# EAGLE design QuadcopterFinal (EAGLE 8.4.1)
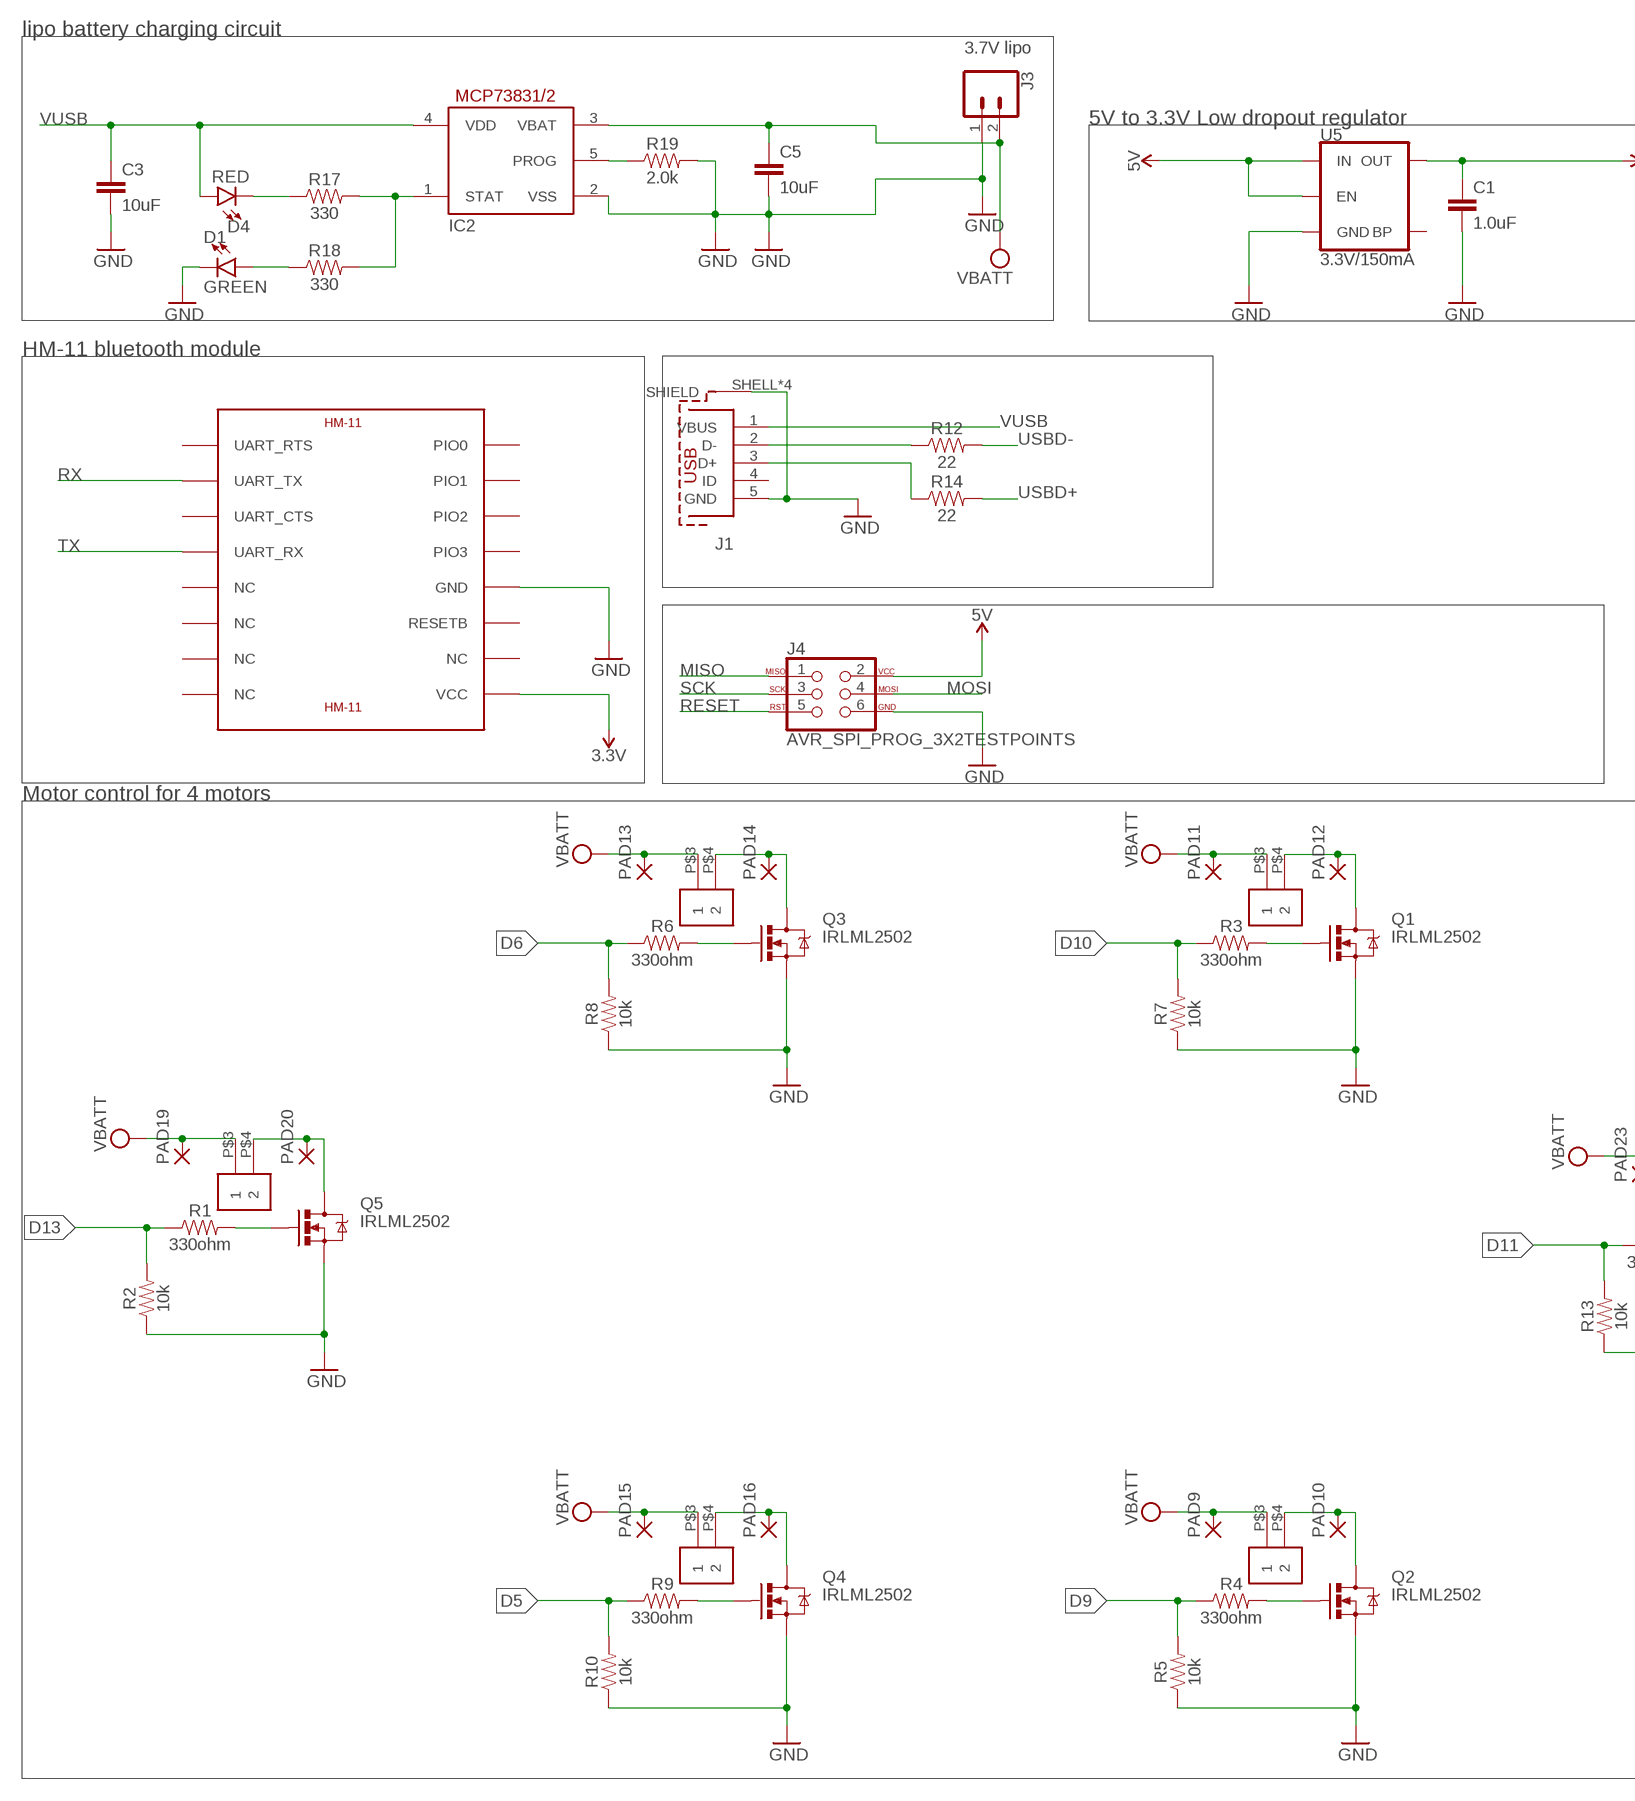
[diagram p0: schematic, sheet 1, part 1 of 2]
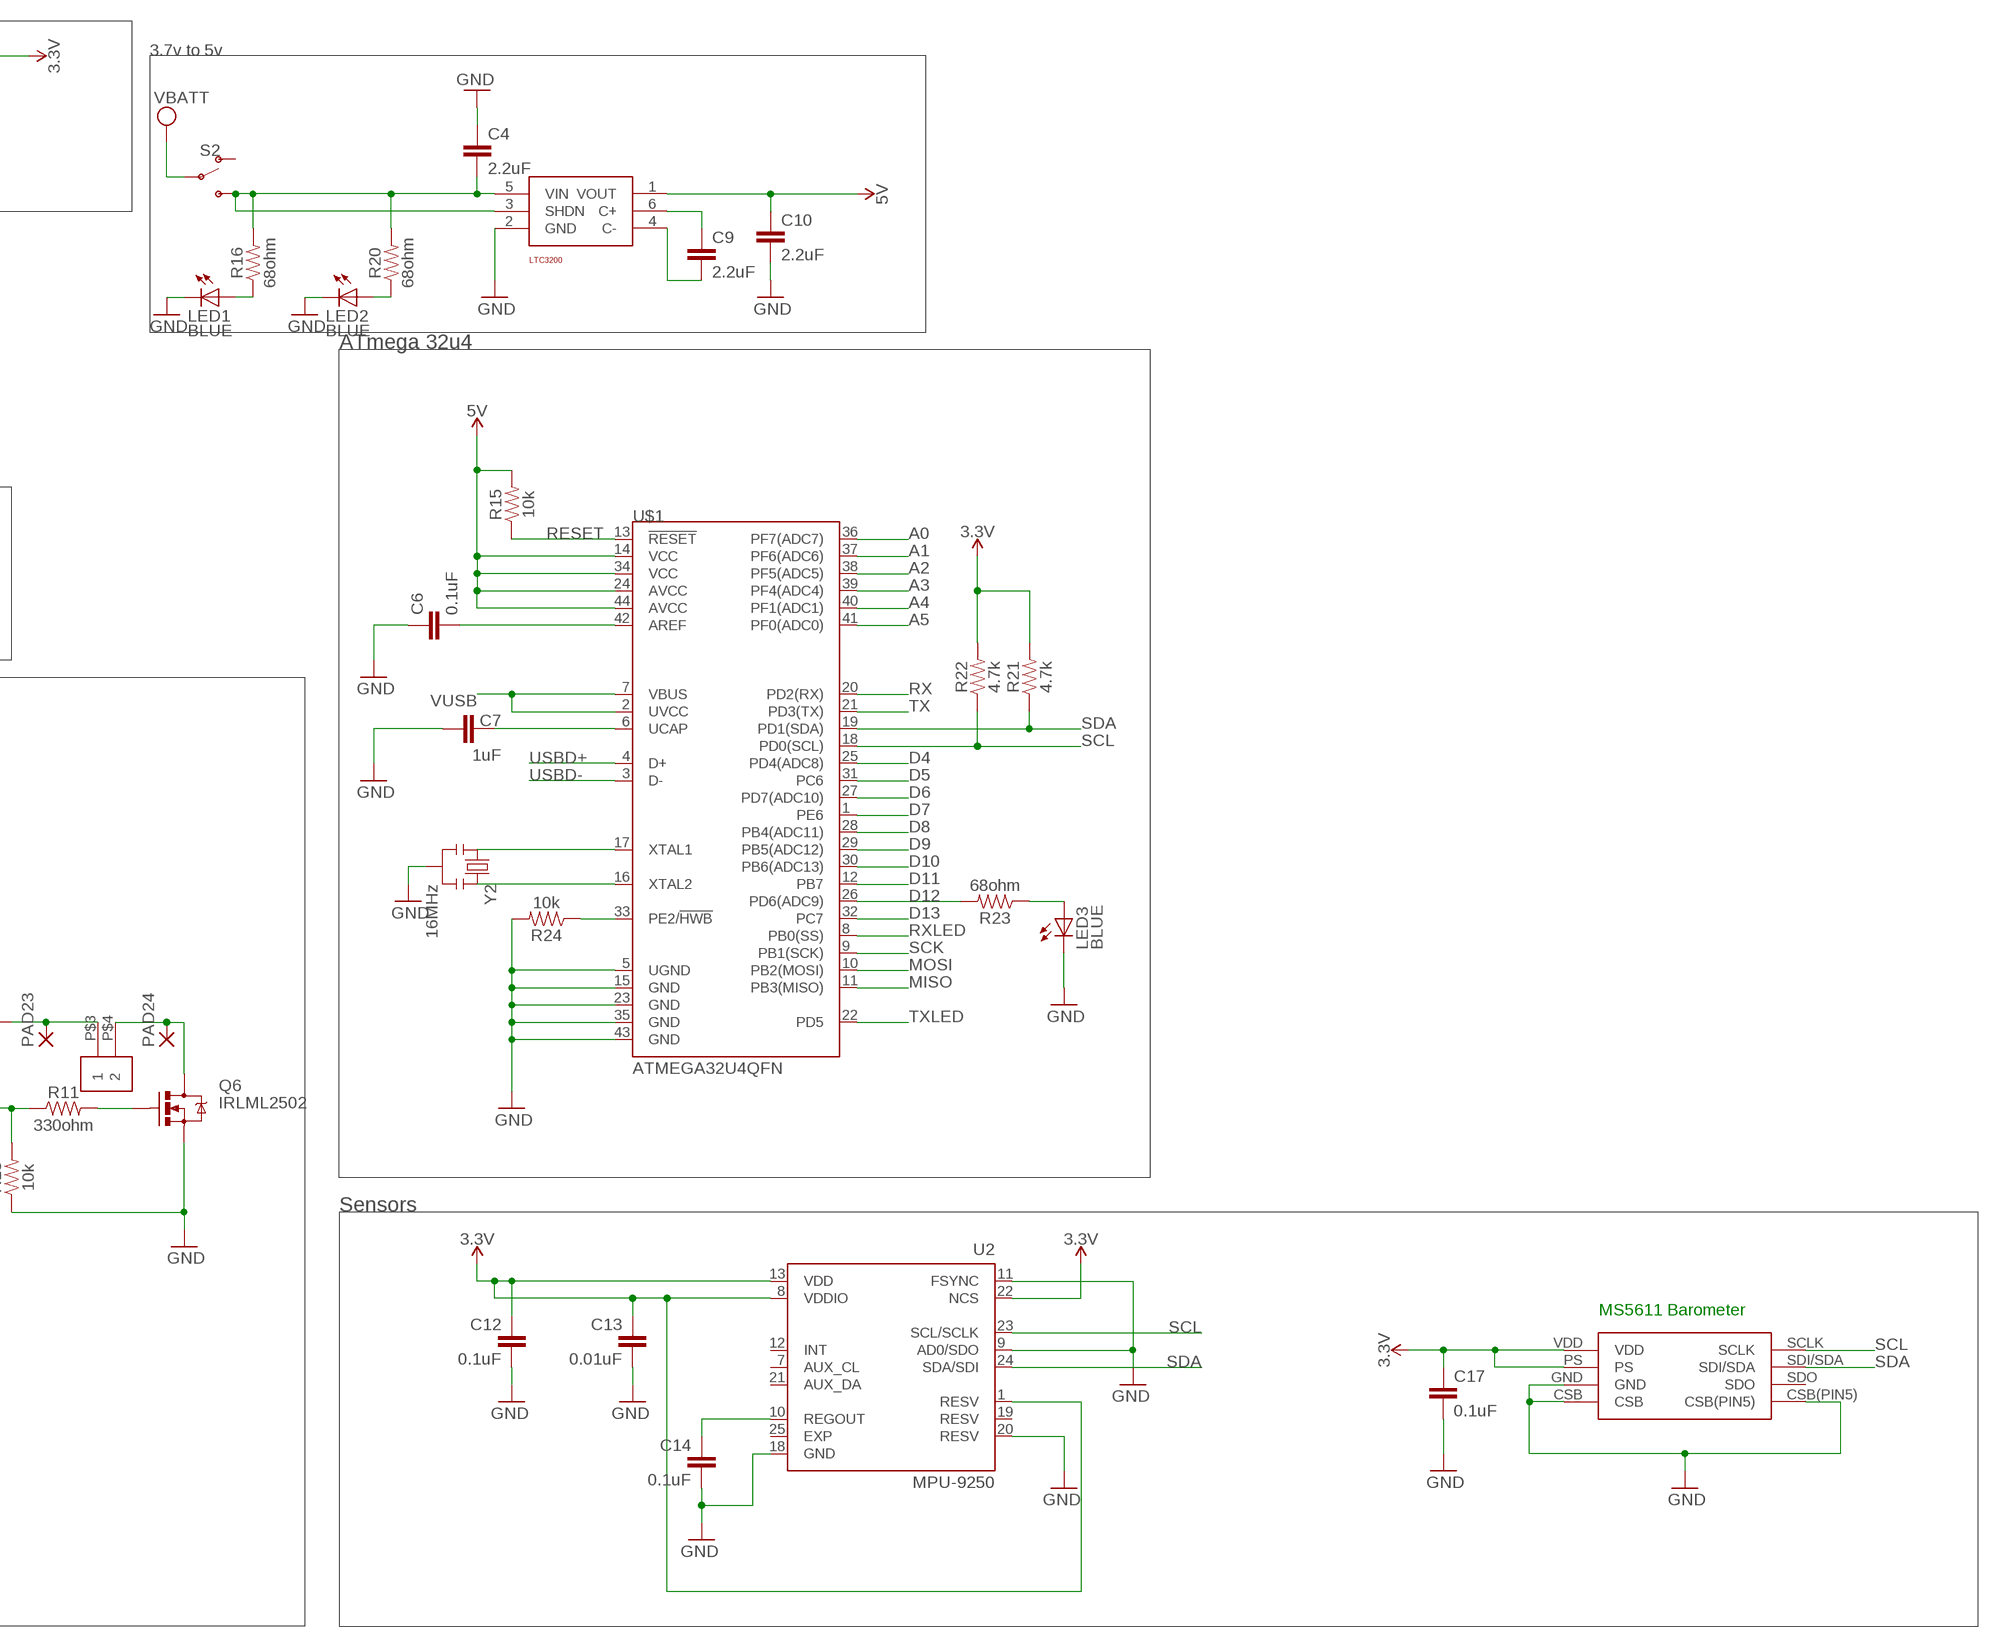
[diagram p1: schematic, sheet 1, part 2 of 2]

## Parts
C1  1.0uF  1.0UF-0402-16V-10%  [0402]
C3  10uF  10UF-0603-6.3V-20%  [0603]
C4  2.2uF  2.2UF-0603-10V-20%  [0603]
C5  10uF  10UF-0603-6.3V-20%  [0603]
C6  0.1uF  0.1UF-0402-16V-10%  [0402]
C7  1uF  0.1UF-0402-16V-10%  [0402]
C9  2.2uF  2.2UF-0603-10V-20%  [0603]
C10  2.2uF  2.2UF-0603-10V-20%  [0603]
C12  0.1uF  0.1UF-0402-16V-10%  [0402]
C13  0.01uF  C-EUC0402  [C0402]
C14  0.1uF  0.1UF-0402-16V-10%  [0402]
C17  0.1uF  0.1UF-0402-16V-10%  [0402]
D1  GREEN  LED-GREEN0603  [LED-0603]
D4  RED  LED-RED0603  [LED-0603]
IC2  MCP73831/OT  [SOT23-5L]
J1  629105136821  [629105136821]
J3  CONN_021X02_NO_SILK  [1X02_NO_SILK]
J4  AVR_SPI_PROG_3X2TESTPOINTS  [2X3_TEST_POINTS]
LED1  BLUE  LEDCHIPLED_1206  [CHIPLED_1206]
LED2  BLUE  LEDCHIPLED_1206  [CHIPLED_1206]
LED3  BLUE  LEDCHIPLED_1206  [CHIPLED_1206]
LTC3200  LTC3200  [LTC3200]
PAD9  SMD2  [SMD1,27-2,54]
PAD10  SMD2  [SMD1,27-2,54]
PAD11  SMD2  [SMD1,27-2,54]
PAD12  SMD2  [SMD1,27-2,54]
PAD13  SMD2  [SMD1,27-2,54]
PAD14  SMD2  [SMD1,27-2,54]
PAD15  SMD2  [SMD1,27-2,54]
PAD16  SMD2  [SMD1,27-2,54]
PAD19  SMD2  [SMD1,27-2,54]
PAD20  SMD2  [SMD1,27-2,54]
PAD23  SMD2  [SMD1,27-2,54]
PAD24  SMD2  [SMD1,27-2,54]
Q1  IRLML2502  MOSFET-NCHANNELBSS138  [SOT23]
Q2  IRLML2502  MOSFET-NCHANNELBSS138  [SOT23]
Q3  IRLML2502  MOSFET-NCHANNELBSS138  [SOT23]
Q4  IRLML2502  MOSFET-NCHANNELBSS138  [SOT23]
Q5  IRLML2502  MOSFET-NCHANNELBSS138  [SOT23]
Q6  IRLML2502  MOSFET-NCHANNELBSS138  [SOT23]
R1  330ohm  330OHM-0603-1/10W-1%  [0603]
R2  10k  10KOHM-0603-1/10W-1%  [0603]
R3  330ohm  330OHM-0603-1/10W-1%  [0603]
R4  330ohm  330OHM-0603-1/10W-1%  [0603]
R5  10k  10KOHM-0603-1/10W-1%  [0603]
R6  330ohm  330OHM-0603-1/10W-1%  [0603]
R7  10k  10KOHM-0603-1/10W-1%  [0603]
R8  10k  10KOHM-0603-1/10W-1%  [0603]
R9  330ohm  330OHM-0603-1/10W-1%  [0603]
R10  10k  10KOHM-0603-1/10W-1%  [0603]
R11  330ohm  330OHM-0603-1/10W-1%  [0603]
R12  22  22OHM-0402-1/10W-1%  [0402]
R13  10k  10KOHM-0603-1/10W-1%  [0603]
R14  22  22OHM-0402-1/10W-1%  [0402]
R15  10k  10KOHM-0603-1/10W-1%  [0603]
R16  68ohm  330OHM-0603-1/10W-1%  [0603]
R17  330  330OHM-0603-1/10W-1%  [0603]
R18  330  330OHM-0603-1/10W-1%  [0603]
R19  2.0k  2.0KOHM-0603-1/10W-5%  [0603]
R20  68ohm  330OHM-0603-1/10W-1%  [0603]
R21  4.7k  4.7KOHM-0603-1/10W-1%  [0603]
R22  4.7k  4.7KOHM-0603-1/10W-1%  [0603]
R23  68ohm  330OHM-0603-1/10W-1%  [0603]
R24  10k  10KOHM-0603-1/10W-1%  [0603]
S2  SWITCH-SPDT-SMD-RIGHT-ANGLE  [SWITCH_SPST_SMD_A]
U2  MPU-9250  [QFN40P300X300X105-25N]
U5  3.3V/150mA  V_REG_MIC52053.3V  [SOT23-5]
U$1  ATMEGA32U4QFN  [SPARKFUN-DIGITALIC_QFN-44]
U$2  QUADARM  [QUADARM]
U$3  QUADARM  [QUADARM]
U$4  QUADARM  [QUADARM]
U$5  QUADARM  [QUADARM]
U$6  HM-11  [HM-11]
U$7  QUADARM  [QUADARM]
U$8  QUADARM  [QUADARM]
U$9  MS5611-01BA01  [MS5611-01BA01]
Y2  16MHz  RESONATOR16MHZ  [RESONATOR-SMD]

## Nets
3.3V: C1.1 C12.1 C13.1 C17.1 R21.2 R22.2 U2.1(RESV) U2.8(VDDIO) U2.13(VDD) U2.22(NCS) U5.5(OUT) U$6.VCC U$9.PS U$9.VDD
5V: C10.1 J4.2 LTC3200.1(VOUT) R15.2 U5.1(IN) U5.3(EN) U$1.14(VCC) U$1.24(AVCC) U$1.34(VCC) U$1.44(AVCC)
A0: U$1.36(PF7(ADC7))
A1: U$1.37(PF6(ADC6))
A2: U$1.38(PF5(ADC5))
A3: U$1.39(PF4(ADC4))
A4: U$1.40(PF1(ADC1))
A5: U$1.41(PF0(ADC0))
D4: U$1.25(PD4(ADC8))
D5: R9.1 R10.2 U$1.31(PC6)
D6: R6.1 R8.2 U$1.27(PD7(ADC10))
D7: U$1.1(PE6)
D8: U$1.28(PB4(ADC11))
D9: R4.1 R5.2 U$1.29(PB5(ADC12))
D10: R3.1 R7.2 U$1.30(PB6(ADC13))
D11: R11.1 R13.2 U$1.12(PB7)
D12: R23.2 U$1.26(PD6(ADC9))
D13: R1.1 R2.2 U$1.32(PC7)
GND: C1.2 C3.2 C4.1 C5.2 C6.1 C7.1 C10.2 C12.2 C13.2 C14.2 C17.2 D1.C IC2.2(VSS) J1.5(GND) J1.SHELL1(SHIELD) J1.SHELL2(SHIELD) J1.SHELL3(SHIELD) J1.SHELL(SHIELD) J3.1 J4.6 LED1.C LED2.C LED3.C LTC3200.2(GND) Q1.2(S) Q2.2(S) Q3.2(S) Q4.2(S) Q5.2(S) Q6.2(S) R2.1 R5.1 R7.1 R8.1 R10.1 R13.1 R19.2 R24.2 U2.9(AD0/SDO) U2.11(FSYNC) U2.18(GND) U2.20(RESV) U5.2(GND) U$1.5(UGND) U$1.15(GND) U$1.23(GND) U$1.35(GND) U$1.43(GND) U$6.GND U$9.CSB U$9.CSB(PIN5) U$9.GND Y2.2
MISO: J4.1 U$1.11(PB3(MISO))
MOSI: J4.4 U$1.10(PB2(MOSI))
N$1: Q5.1(G) R1.2
N$2: C4.2 LTC3200.3(SHDN) LTC3200.5(VIN) R16.2 R20.2 S2.3(S)
N$3: PAD20.1(P) Q5.3(D) U$7.P$4
N$4: Q6.1(G) R11.2
N$5: LED1.A R16.1
N$7: PAD24.1(P) Q6.3(D) U$8.P$4
N$8: Q1.1(G) R3.2
N$9: PAD12.1(P) Q1.3(D) U$3.P$4
N$10: LED2.A R20.1
N$11: Q2.1(G) R4.2
N$12: PAD10.1(P) Q2.3(D) U$2.P$4
N$13: J1.2(D-) R12.1
N$14: Q3.1(G) R6.2
N$15: PAD14.1(P) Q3.3(D) U$4.P$4
N$16: J1.3(D+) R14.1
N$17: Q4.1(G) R9.2
N$18: PAD16.1(P) Q4.3(D) U$5.P$4
N$22: U$1.17(XTAL1) Y2.1
N$23: C9.1 LTC3200.6(C+)
N$24: C14.1 U2.10(REGOUT)
N$25: C9.2 LTC3200.4(C-)
N$26: D4.C R17.1
N$27: IC2.1(STAT) R17.2 R18.2
N$28: D1.A R18.1
N$29: U$1.16(XTAL2) Y2.3
N$30: LED3.A R23.1
N$32: IC2.5(PROG) R19.1
N$33: R24.1 U$1.33(PE2/!HWB)
N$34: C6.2 U$1.42(AREF)
N$36: C7.2 U$1.6(UCAP)
RESET: J4.5 R15.1 U$1.13(!RESET)
RX: U$1.20(PD2(RX)) U$6.UART_TX
RXLED: U$1.8(PB0(SS))
SCK: J4.3 U$1.9(PB1(SCK))
SCL: R22.1 U2.23(SCL/SCLK) U$1.18(PD0(SCL)) U$9.SCLK
SDA: R21.1 U2.24(SDA/SDI) U$1.19(PD1(SDA)) U$9.SDI/SDA
TX: U$1.21(PD3(TX)) U$6.UART_RX
TXLED: U$1.22(PD5)
USBD+: R14.2 U$1.4(D+)
USBD-: R12.2 U$1.3(D-)
VDD: C5.1 IC2.3(VBAT) J3.2 PAD9.1(P) PAD11.1(P) PAD13.1(P) PAD15.1(P) PAD19.1(P) PAD23.1(P) S2.2(P) U$2.P$3 U$3.P$3 U$4.P$3 U$5.P$3 U$7.P$3 U$8.P$3 ; supply symbol labelled VBATT
VUSB: C3.1 D4.A IC2.4(VDD) J1.1(VBUS) U$1.2(UVCC) U$1.7(VBUS)
Unconnected: J1.4(ID) S2.1(O) U2.7(AUX_CL) U2.12(INT) U2.21(AUX_DA) U5.4(BP) U$6.NC@5(NC) U$6.NC@6(NC) U$6.NC@7(NC) U$6.NC@8(NC) U$6.NC@10(NC) U$6.PIO0 U$6.PIO1 U$6.PIO2 U$6.PIO3 U$6.RESETB U$6.UART_CTS U$6.UART_RTS U$9.SDO

## Notes on the sheet
- lipo battery charging circuit
- 3.7V lipo
- 5V to 3.3V Low dropout regulator
- 3.7v to 5v
- HM-11 bluetooth module
- ATmega 32u4
- Motor control for 4 motors
- Sensors
- MS5611 Barometer

## Power pins joined to a net without a drawn wire
EXP: U2.25(EXP)
RESV: U2.19(RESV)

## Library data of the parts
C1 = SparkFun-Capacitors:1.0UF: 1µF ceramic capacitors A capacitor is a passive two-terminal electrical component used to store electrical energy temporarily in an electric field.; PROD_ID: CAP-12417
C3 C5 = SparkFun-Capacitors:10UF: 10.0µF ceramic capacitors A capacitor is a passive two-terminal electrical component used to store electrical energy temporarily in an electric field.; PROD_ID: CAP-11015
C4 C9 C10 = SparkFun-Capacitors:2.2UF: 2.2µF ceramic capacitors A capacitor is a passive two-terminal electrical component used to store electrical energy temporarily in an electric field.; PROD_ID: CAP-07888
C6 C12 C14 C17 = SparkFun-Capacitors:0.1UF: 0.1µF ceramic capacitors A capacitor is a passive two-terminal electrical component used to store electrical energy temporarily in an electric field.; PROD_ID: CAP-12416
C7 = SparkFun-Capacitors:0.1UF: 0.1µF ceramic capacitors A capacitor is a passive two-terminal electrical component used to store electrical energy temporarily in an electric field.; PROD_ID: CAP-12416; VALUE: 0.1uF
C13 = rcl:C-EU: CAPACITOR, European symbol
D1 = SparkFun-LED:LED-GREEN: Green SMD LED Used in manufacturing of various products at SparkFun Packages: 0603 - SMD 0603 package [Product Link] <http://www.futureelectronics.com/en/technologies/semiconductors/optoelectronics/leds/Pages/9894312-LTST-C190GKT.aspx?CrossPart=HSMG-C190&IM=0> LilyPad 1206 - SMD1206 LilyPad package [Product Link] <http://www.futureelectronics.com/en/Technologies/Product.aspx?ProductID=IN150NGHARVATEKCORPORATION2049943&IM=0> 1206 - SMD1206 package [Product Link] <http://www.futureelectronics.com/en/technologies/semiconductors/optoelectronics/leds/Pages/8315665-LTST-C150KGKT.aspx?IM=0> 1206 Bottom Mount -SMD 1206 Bottom Mount [Product Link] <http://www.digikey.com/product-detail/en/lite-on-inc/LTST-C230KGKT/160-1456-1-ND/386854> SparkFun Products: Pro Mini 328 -5V <https://www.sparkfun.com/products/821> RedBoard <https://www.sparkfun.com/products/12757> MP3 Trigger <https://www.sparkfun.com/products/13720> Makey Makey <https://www.sparkfun.com/products/11076>; PROD_ID: DIO-00821
D4 = SparkFun-LED:LED-RED: Red SMD LED Used in manufacturing of most products at SparkFun Packages: 0603 - SMD 0603 package [Product Link] <http://docs.avagotech.com/docs/AV02-0551EN> 0603 SMART - SMD 0603 SMART package ( more efficient and expensive)[Product Link] <http://www.osram-os.com/Graphics/XPic2/00077099_0.pdf> 1206 - SMD1206 package [Product Link] <https://www.sparkfun.com/datasheets/DevTools/LilyPad/Q150OVS4.pdff> SparkFun Products: Pro Mini 328 -5V <https://www.sparkfun.com/products/821> RedBoard <https://www.sparkfun.com/products/12757> IOIO-OTG <https://www.sparkfun.com/products/13613>; PROD_ID: DIO-00819
IC2 = adafruit:MCP73831: MCP73831/2 Miniature Single-Cell, Fully Integrated Li-Ion, Li-Polymer Charge Management Controllers. Nice and small simple lipoly charge controller, with adjustable current and status output (LED) http://www.ladyada.net/library/pcb/eaglelibrary.html
J1 = EAGLE-INPUT_OUTPUT_CONNECTORS-rev17b:629105136821: WR-COM SMT Horizontal 5 Contacts Micro USB Type B,5 pins=>Code : Con_I-O_COM_MicroUSB_629105136821 <http://katalog.we-online.de/media/images/eican/Con_I-O_COM_MicroUSB_629105136821_pf2.jpg> Details see: http://katalog.we-online.de/en/em/COM_MICRO_SMT_TYPE_B_HORIZONTAL/629105136821?m Created 2014-07-09, Karrer Zheng 2014 (C) Würth Elektronik
J3 = SparkFun-Connectors:CONN_02: Multi connection point. Often used as Generic Header-pin footprint for 0.1 inch spaced/style header connections On any of the 0.1 inch spaced packages, you can populate with these: Break Away Headers - Straight <https://www.sparkfun.com/products/116> (PRT-00116) Break Away Male Headers - Right Angle <https://www.sparkfun.com/products/553> (PRT-00553) Female Headers <https://www.sparkfun.com/products/115> (PRT-00115) Break Away Headers - Machine Pin <https://www.sparkfun.com/products/117> (PRT-00117) Break Away Female Headers - Swiss Machine Pin <https://www.sparkfun.com/products/743> (PRT-00743) For SCREWTERMINALS and SPRING TERMINALS visit here: Screw Terimnals on SparkFun.com <https://www.sparkfun.com/search/results?term=Screw+Terminals> (5mm/3.5mm/2.54mm spacing) This device is also useful as a general connection point to wire up your design to another part of your project. Our various solder wires solder well into these plated through hole pads. Hook-Up Wire - Assortment (Stranded, 22 AWG) <https://www.sparkfun.com/products/11375> (PRT-11375) Hook-Up Wire - Assortment (Solid Core, 22 AWG) <https://www.sparkfun.com/products/11367> (PRT-11367) View the entire wire category on our website here <https://www.sparkfun.com/categories/141> Special notes: Molex polarized connector foot print use with: PRT-08233 with associated crimp pins and housings. 2.54_SCREWTERM for use with PRT-10571. 3.5mm Screw Terminal footprints for PRT-08084 5mm Screw Terminal footprints for use with PRT-08432
J4 = SparkFun-Connectors:AVR_SPI_PROG_3X2: AVR ISP 6 Pin This is the reduced ISP connector for AVR programming. Common on Arduino. This footprint will take up less PCB space and can be used with a 10-pin to 6-pin adapter such as SKU: BOB-08508 **Special note about "TEST_POINT" package. The stop mask is on the top side, so if you want your programming test points to be on the bottom of your board, make sure to place this package on the bottom side of the board. This also ensure that the orientation to program from the bottom side will be correct. SparkFun Products: SparkFun ISP Pogo Adapter <https://www.sparkfun.com/products/11591> - NS Tiny AVR Programmer <https://www.sparkfun.com/products/11801> -PTH
LED1-LED3 = adafruit:LED: LED OSRAM: - CHIPLED LG R971, LG N971, LY N971, LG Q971, LY Q971, LO R971, LY R971 LH N974, LH R974 LS Q976, LO Q976, LY Q976 LO Q996 - Hyper CHIPLED LW Q18S LB Q993, LB Q99A, LB R99A - SideLED LS A670, LO A670, LY A670, LG A670, LP A670 LB A673, LV A673, LT A673, LW A673 LH A674 LY A675 LS A676, LA A676, LO A676, LY A676, LW A676 LS A679, LY A679, LG A679 - Hyper Micro SIDELED® LS Y876, LA Y876, LO Y876, LY Y876 LT Y87S - SmartLED LW L88C, LW L88S LB L89C, LB L89S, LG L890 LS L89K, LO L89K, LY L89K LS L896, LA L896, LO L896, LY L896 - TOPLED LS T670, LO T670, LY T670, LG T670, LP T670 LSG T670, LSP T670, LSY T670, LOP T670, LYG T670 LG T671, LOG T671, LSG T671 LB T673, LV T673, LT T673, LW T673 LH T674 LS T676, LA T676, LO T676, LY T676, LB T676, LH T676, LSB T676, LW T676 LB T67C, LV T67C, LT T67C, LS T67K, LO T67K, LY T67K, LW E67C LS E67B, LA E67B, LO E67B, LY E67B, LB E67C, LV E67C, LT E67C LW T67C LS T679, LY T679, LG T679 LS T770, LO T770, LY T770, LG T770, LP T770 LB T773, LV T773, LT T773, LW T773 LH T774 LS E675, LA E675, LY E675, LS T675 LS T776, LA T776, LO T776, LY T776, LB T776 LHGB T686 LT T68C, LB T68C - Hyper Mini TOPLED® LB M676 - Mini TOPLED Santana® LG M470 LS M47K, LO M47K, LY M47K Source: http://www.osram.convergy.de/; OC_NEWARK: unknown
LTC3200 = QuadcopterFinal:LTC3200: Smooth 5v output
PAD9-PAD16 PAD19 PAD20 PAD23 PAD24 = wirepad:SMD2: SMD PAD; OC_NEWARK: unknown
Q1-Q6 = SparkFun-DiscreteSemi:MOSFET-NCHANNEL: Common NMOSFET Parts MFG P/N Store ID Prod ID FDD8780 TRANS-09984 SI7820DN TRANS-11055 FDS6630A IC-08089 2N7002PW TRANS-11151 FQP30N06L COM-10213 TRANS-10060 BSS123LT1G TRANS-08345 BSS138 TRANS-00830 BS170 2N7000; OC_NEWARK: unknown; PROD_ID: TRANS-00830
R1 R3 R4 R6 R9 R11 R16 R20 R23 = SparkFun-Resistors:330OHM: 330Ω resistor A resistor is a passive two-terminal electrical component that implements electrical resistance as a circuit element. Resistors act to reduce current flow, and, at the same time, act to lower voltage levels within circuits. - Wikipedia; OC_NEWARK: unknown; PROD_ID: RES-00818; VALUE: 330
R2 R5 R7 R8 R10 R13 R15 R24 = SparkFun-Resistors:10KOHM: 10kΩ resistor A resistor is a passive two-terminal electrical component that implements electrical resistance as a circuit element. Resistors act to reduce current flow, and, at the same time, act to lower voltage levels within circuits. - Wikipedia; OC_NEWARK: unknown; PROD_ID: RES-00824
R12 R14 = SparkFun-Resistors:22OHM: 22Ω resistor A resistor is a passive two-terminal electrical component that implements electrical resistance as a circuit element. Resistors act to reduce current flow, and, at the same time, act to lower voltage levels within circuits. - Wikipedia; PROD_ID: RES-12427
R17 R18 = SparkFun-Resistors:330OHM: 330Ω resistor A resistor is a passive two-terminal electrical component that implements electrical resistance as a circuit element. Resistors act to reduce current flow, and, at the same time, act to lower voltage levels within circuits. - Wikipedia; PROD_ID: RES-00818
R19 = SparkFun-Resistors:2.0KOHM: 2kΩ resistor A resistor is a passive two-terminal electrical component that implements electrical resistance as a circuit element. Resistors act to reduce current flow, and, at the same time, act to lower voltage levels within circuits. - Wikipedia; PROD_ID: RES-08296
R21 R22 = SparkFun-Resistors:4.7KOHM: 4.7kΩ resistor A resistor is a passive two-terminal electrical component that implements electrical resistance as a circuit element. Resistors act to reduce current flow, and, at the same time, act to lower voltage levels within circuits. - Wikipedia; PROD_ID: RES-07857
S2 = SparkFun-Switches:SWITCH-SPDT: Single Pole, Double Throw (SPDT) Switch Single-pole, double-throw (SPDT) switch. Variant Overview SMD-AYZ0202 Surface Mount DPDT Switch <https://www.sparkfun.com/products/597> (COM-00597) Used on e.g. LilyPad Arduino USB - ATmega32U4 Board <https://www.sparkfun.com/products/12049> PTH-11.6X4.0MM SPDT Mini Power Switch <https://www.sparkfun.com/products/102> (COM-00102) Used on e.g. SparkFun Simon Says - Through-Hole Soldering Kit <https://www.sparkfun.com/products/10547> (KIT-10547) PTH-11.6X4.0MM-KIT KIT version of SPDT Mini Power Switch - Simplifies soldering by removing tStop of switch pins - only one side can be soldered. PTH-11.6X4.0MM-LOCK LOCK version of SPDT Mini Power Switch - Offset pins hold switch in place for easier soldering. SMD-RIGHT-ANGLE Surface Mount Right Angle Switch <https://www.sparkfun.com/products/10860> (COM-10860) Used on e.g. SparkFun ESP8266 Thing <https://www.sparkfun.com/products/13231>; PROD_ID: SWCH-10651; SF_SKU: COM-10860
U2 = MPU-9250:MPU-9250: GYRO/ACCEL/COMPASS/9-AXIS; AVAILABILITY: Good; DESCRIPTION: SMD Gyroscope/Accelerometer/Magnetometer Sensor%3B 9-AXIS; MF: InvenSense; MP: MPU-9250; PACKAGE: QFN-24 InvenSense; PRICE: 6.33 USD
U5 = SparkFun-IC-Power:V_REG_MIC5205: V_REG MIC5205 Standard 3.3V, 5V, and Adjustable 150mA LDO voltage regulator in SOT-23 layout. Micrel part MIC5205. BP (by-pass) pin is used to lower output noise with 470pF cap, may be left open. On the adjustable version BP is used to set output.; PROD_ID: VREG-00822
U$1 = SparkFun-Retired:ATMEGA32U4: Atmel 44-pin 8-bit Microcontroller with 32KBytes of ISP Flash and USB Controller ----- Please use the QFN-44-NOPAD_1:1 package for the footprint of all boards using a 32U4. Route traces directly away from the pads as much as possible.
U$2-U$5 U$7 U$8 = quadcopter:QUADARM; OC_NEWARK: unknown
U$6 = HM-11:HM-11: JNHuaMao HM-11 Bluetooth 4.0 Transceiver based on TI CC2540/CC2541
U$9 = freeimu-components:MS5611-01BA01
Y2 = SparkFun-FreqCtrl:RESONATOR: Resonator Small SMD resonator. Used, eg, on the Arduino Pro/ Pro Mini boards. 8MHz- XTAL-08895 16MHz- XTAL-08900; OC_NEWARK: unknown; PROD_ID: XTAL-08900

## Board
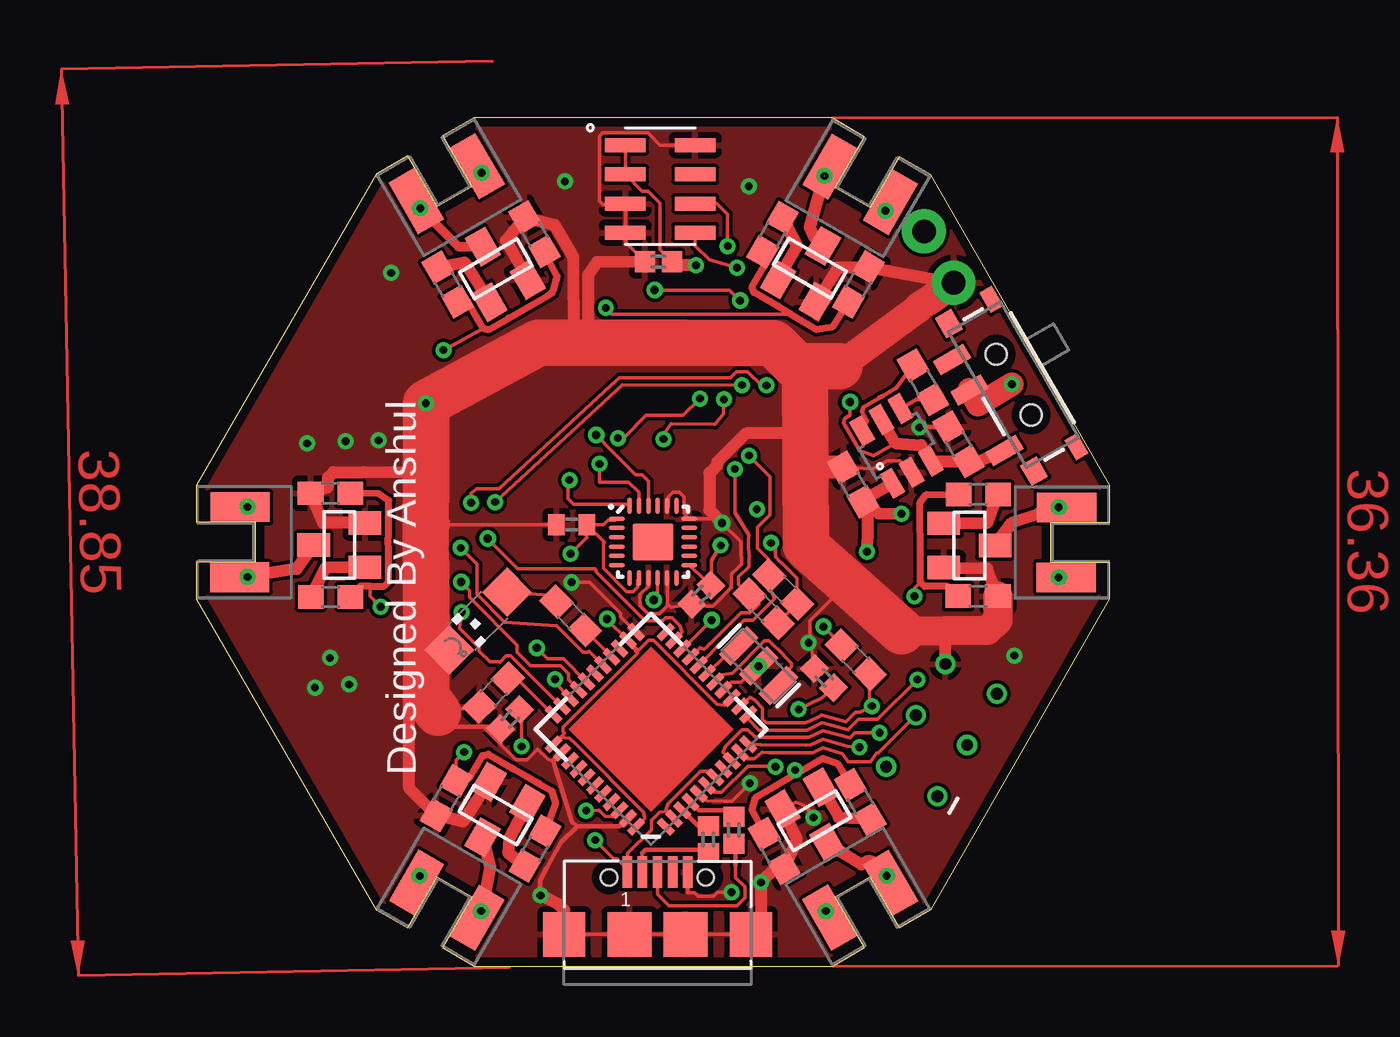
[diagram p2: board, top side]
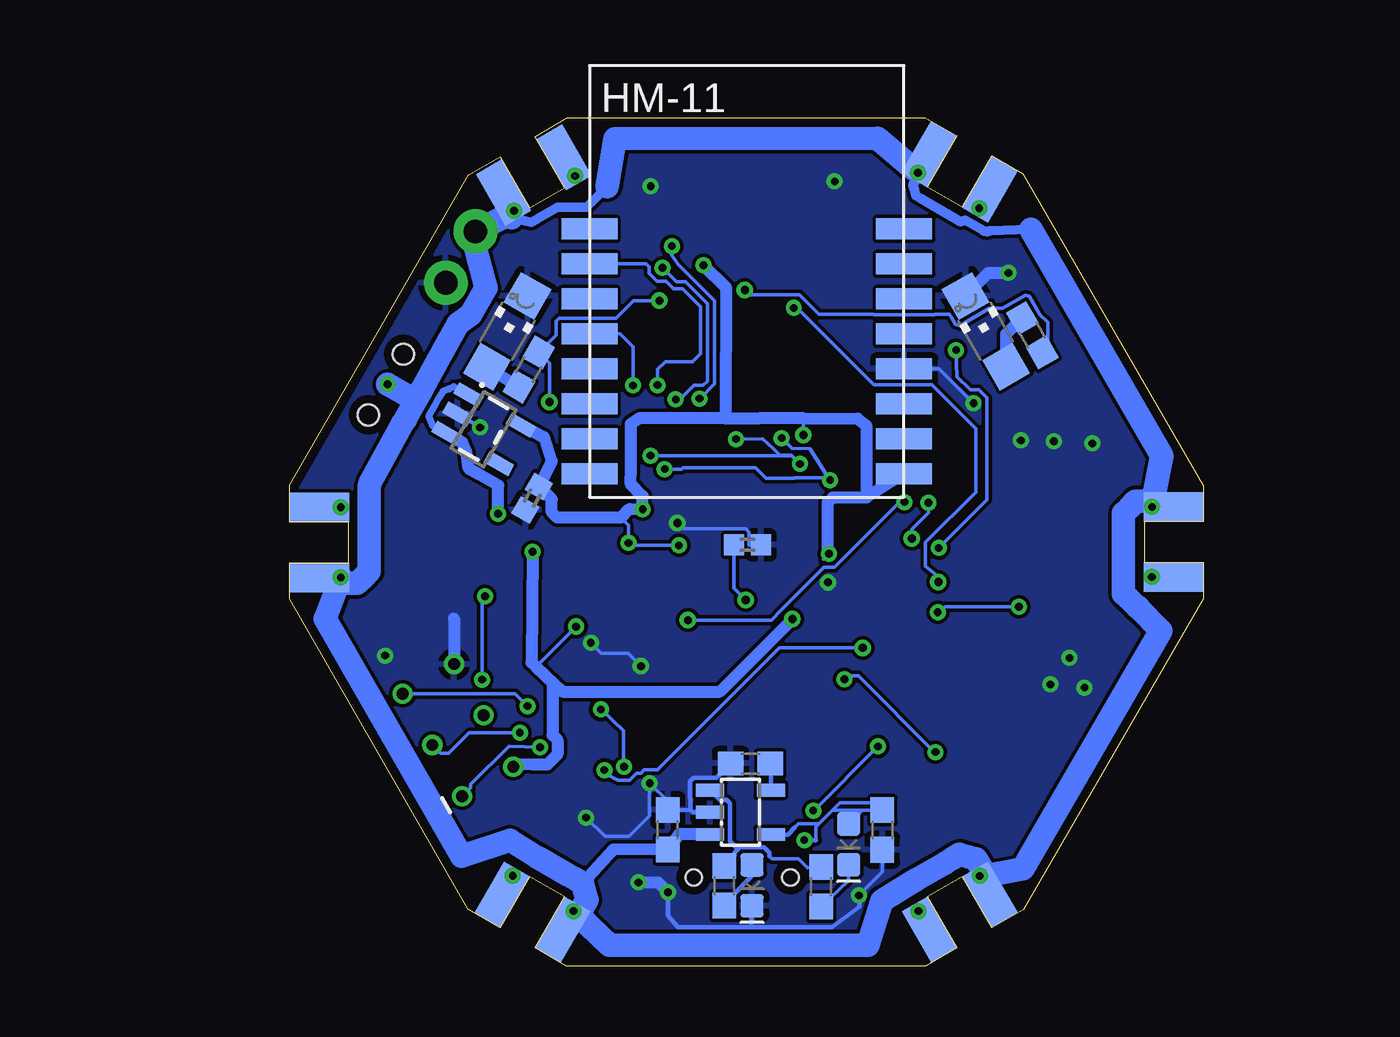
[diagram p3: board, bottom side, seen from below]

Size 39.18 x 36.37 mm. Coordinates in mm from the lower left corner, seen from the top.
Outline: 36.65,17.3 36.65,19.02 39.17,19.02 39.18,20.62 31.5,33.91 30.14,34.69 28.89,32.51 27.38,33.37 28.65,35.56 27.27,36.36 11.9,36.37 10.55,35.6 11.82,33.41 10.32,32.54 9.05,34.73 7.73,33.98 0,20.59 0,19.04 2.53,19.04 2.53,17.31 0,17.31 0,15.75 7.7,2.42 9.06,1.64 10.32,3.83 11.82,2.97 10.55,0.78 11.9,0 27.3,0 28.65,0.78 27.38,2.97 28.88,3.83 30.14,1.64 31.51,2.43 39.17,15.74 39.17,17.3 36.65,17.3
Copper layers (1*16): Top 0.0356mm / dielectric 1.5011mm / Bottom 0.0356mm
Design rules "LaenPCBOrder": minimum track width 6mil, minimum drill 13mil, track to track 6mil, track to pad 6mil, pad to pad 6mil, via to via 6mil, smd to smd 6mil, copper to edge 15mil, drill to drill 6mil, minimum pad ring 7mil, minimum via ring 7mil, stop-mask expansion 4mil, vias tented up to drill 0mil, thermal gap 10mil

### Footprints (pad centres in the part's own frame; a part is rotated, then mirrored left to right if it is on the bottom)
0402 = smd 0.85 x 0.9: 1 -0.58,0; 2 0.58,0
0603 = smd 1.1 x 1: 1 -0.85,0; 2 0.85,0
C0402 = smd 0.7 x 0.9: 1 -0.65,0; 2 0.65,0
LED-0603 = smd 1 x 1: A -0.877,0; C 0.877,0
SOT23-5L = smd 0.55 x 1.2: 1 -0.95,-1.3; 2 0,-1.3; 3 0.95,-1.3; 4 0.95,1.3; 5 -0.95,1.3
629105136821 = smd 0.4 x 1.35: 1 -1.3,2.675; 2 -0.65,2.675; 3 0,2.675; 4 0.65,2.675; 5 1.3,2.675 | smd 1.8 x 1.9: SHELL -4,0; SHELL3 4,0 | smd 1.9 x 1.9: SHELL1 -1.2,0; SHELL2 1.2,0 | hole 0.7: -2.075,2.45; 2.075,2.45
1X02_NO_SILK = drill 1.016 pad 1.88: 1 0,0; 2 2.54,0
2X3_TEST_POINTS = drill 0.508: 1 -2.54,-1.27; 2 -2.54,1.27; 3 0,-1.27; 4 0,1.27; 5 2.54,-1.27; 6 2.54,1.27
CHIPLED_1206 = smd 1.5 x 1.5: A 0,-1.75; C 0,1.75
LTC3200 = smd 1.2 x 0.6: 1 0,0; 2 0,-0.95; 3 0,-1.9; 4 2.6,-1.9; 5 2.6,-0.95; 6 2.6,0
SMD1,27-2,54 = smd 1.27 x 2.54: 1 0,0
SOT23 = smd 1 x 1.4: 1 -0.95,-1.1; 2 0.95,-1.1; 3 0,1.1
SWITCH_SPST_SMD_A = smd 0.7 x 1.5: 1 -2.25,-1.75; 2 -0.75,-1.75; 3 2.25,-1.75 | smd 1 x 0.6: GND1 -3.65,1; GND3 3.65,1 | smd 1 x 0.8: GND2 -3.65,-1.1; GND4 3.65,-1.1 | hole 0.9: -1.5,0; 1.5,0
QFN40P300X300X105-25N = smd 0.7 x 0.2: 1 -1.55,1; 2 -1.55,0.6; 3 -1.55,0.2; 4 -1.55,-0.2; 5 -1.55,-0.6; 6 -1.55,-1; 13 1.55,-1; 14 1.55,-0.6; 15 1.55,-0.2; 16 1.55,0.2; 17 1.55,0.6; 18 1.55,1 | smd 0.2 x 0.7: 7 -1,-1.55; 8 -0.6,-1.55; 9 -0.2,-1.55; 10 0.2,-1.55; 11 0.6,-1.55; 12 1,-1.55; 19 1,1.55; 20 0.6,1.55; 21 0.2,1.55; 22 -0.2,1.55; 23 -0.6,1.55; 24 -1,1.55 | smd 1.75 x 1.6: 25 0,0
SOT23-5 = smd 0.55 x 1.2: 1 -0.95,-1.3; 2 0,-1.3; 3 0.95,-1.3; 4 0.95,1.3; 5 -0.95,1.3
SPARKFUN-DIGITALIC_QFN-44 = smd 0.8 x 0.3: 1 -3.4,2.5; 2 -3.4,2; 3 -3.4,1.5; 4 -3.4,1; 5 -3.4,0.5; 6 -3.4,0; 7 -3.4,-0.5; 8 -3.4,-1; 9 -3.4,-1.5; 10 -3.4,-2; 11 -3.4,-2.5; 23 3.4,-2.5; 24 3.4,-2; 25 3.4,-1.5; 26 3.4,-1; 27 3.4,-0.5; 28 3.4,0; 29 3.4,0.5; 30 3.4,1; 31 3.4,1.5; 32 3.4,2; 33 3.4,2.5 | smd 0.3 x 0.8: 12 -2.5,-3.4; 13 -2,-3.4; 14 -1.5,-3.4; 15 -1,-3.4; 16 -0.5,-3.4; 17 0,-3.4; 18 0.5,-3.4; 19 1,-3.4; 20 1.5,-3.4; 21 2,-3.4; 22 2.5,-3.4; 34 2.5,3.4; 35 2,3.4; 36 1.5,3.4; 37 1,3.4; 38 0.5,3.4; 39 0,3.4; 40 -0.5,3.4; 41 -1,3.4; 42 -1.5,3.4; 43 -2,3.4; 44 -2.5,3.4
QUADARM = smd 2.54 x 1.27 rotated 135: P$3 -0.542,2.137; P$4 -2.681,0.021
HM-11 = smd 2.4 x 0.9: GND 6.5,0; NC@5 -7,0; NC@6 -7,-1.5; NC@7 -7,-3; NC@8 -7,-4.5; NC@10 6.5,-3; PIO0 6.5,6; PIO1 6.5,4.5; PIO2 6.5,3; PIO3 6.5,1.5; RESETB 6.5,-1.5; UART_CTS -7,3; UART_RTS -7,6; UART_RX -7,1.5; UART_TX -7,4.5; VCC 6.5,-4.5
MS5611-01BA01 = smd 1.75 x 0.6: CSB 0,0.5; CSB(PIN5) 3,4.25; GND 0,1.75; PS 0,3; SCLK 3,0.5; SDI/SDA 3,1.75; SDO 3,3; VDD 0,4.25
RESONATOR-SMD = smd 0.7 x 1.7: 1 -1.2,0; 2 0,0; 3 1.2,0

### Placement (x,y rotation side)
C1  28.77,20.06 240 bottom
C3  13.75,5.84 270 bottom
C4  32.68,22.38 300 top
C5  22.95,5.85 90 bottom
C6  13.45,10.59 45 top
C7  26.92,12.35 315 top
C9  31.15,25.03 300 top
C10  28.17,20.65 120 top
C12  21.65,15.92 225 top
C13  16.09,18.93 180 top
C14  19.54,18.06 0 bottom
C17  19.81,30.19 180 top
D1  19.35,3.47 270 bottom
D4  15.2,5.22 270 bottom
IC2  19.84,6.6 270 bottom
J1  19.77,1.36 0 top
J3  32.47,29.3 120 top
J4  31.95,10.11 60 top
LED1  29.84,27.21 330 bottom
LED2  9.32,27.21 30 bottom
LED3  12.08,14.79 135 top
LTC3200  29.85,20.7 120 top
PAD9  27.46,1.57 330 bottom
PAD10  30.06,3.06 330 bottom
PAD11  30,33.16 30 bottom
PAD12  27.4,34.67 30 bottom
PAD13  11.75,34.8 150 bottom
PAD14  9.14,33.29 150 bottom
PAD15  9.14,3.06 30 bottom
PAD16  11.74,1.56 30 bottom
PAD19  1.28,19.68 270 bottom
PAD20  1.28,16.67 270 bottom
PAD23  37.9,16.66 270 bottom
PAD24  37.9,19.66 270 bottom
Q1  26.32,29.92 330 top
Q2  26.51,6.24 210 top
Q3  12.84,29.89 30 top
Q4  12.82,6.48 150 top
Q5  6.13,18.05 90 top
Q6  33.15,18.03 270 top
R1  5.76,15.83 180 top
R2  5.75,20.27 0 top
R3  24.71,31.35 60 top
R4  28.47,7.05 300 top
R5  24.77,4.94 120 top
R6  10.77,29.22 120 top
R7  28.39,29.21 240 top
R8  14.5,31.37 300 top
R9  14.52,5.04 240 top
R10  10.71,7.2 60 top
R11  33.53,20.21 0 top
R12  21.95,5.43 90 top
R13  33.52,15.86 180 top
R14  23.05,5.83 90 top
R15  28.27,13.14 135 top
R16  28.92,25.57 60 bottom
R17  16.38,3.4 90 bottom
R18  20.53,3.44 90 bottom
R19  19.41,8.69 180 bottom
R20  7.33,27.05 300 bottom
R21  24.33,15.32 315 top
R22  25.16,16.14 315 top
R23  16.05,15.02 315 top
R24  12.75,11.72 225 top
S2  35.04,24.93 300 top
U2  19.58,18.18 0 top
U5  30.85,23.02 240 bottom
U$1  19.49,10.15 135 top
U$2  27.19,4.29 165 top
U$3  27.84,31.67 285 top
U$4  12.01,32.09 345 top
U$5  11.37,4.66 105 top
U$6  19.32,25.6 0 bottom
U$7  3.77,18.55 45 top
U$8  35.4,17.79 225 top
U$9  18.39,30.94 0 top
Y2  24.11,12.87 315 top

### Tracks (layer width: path | path; a pad name or v marks a point on that pad's centre or on a via)
3.3V  (via drill 0.33, 0.35)
  Top 0.152: v24.64,18.14 24.83,17.95 24.83,17.55 25.03,17.34 25.09,17.29 25.74,16.63 25.74,15.51 R22.2 25.71,15.49 R21.2 | v16.04,17.68 v16.05,17.67 16.74,18.36 | U$9.VDD U$9.PS 19.11,33.22 19.36,33.22 19.89,32.69 19.89,30.7 C17.1 | 16.74,18.36 16.75,18.37 | v17.14,22.77 17.5,22.41 17.5,22.4 18.84,21.07 19.11,21.07 19.38,20.8 U2.22 | U2.13 C12.1 22.09,17.38 v22.48,18.04 | C13.1 17.5,18.16 17.45,18.12 17.45,17.05 18.45,16.05 18.72,16.05 18.91,16.25 18.91,16.56 U2.8 | C13.1 16.74,18.36 | C13.1 17.46,18.93 17.65,19.11 17.96,19.11 U2.1
  Top 0.508: v21.42,30.04 20.54,30.04 C17.1
  Bottom 0.152: 24.96,19.23 24.64,18.9 v24.64,18.14 24.54,18.04 v22.48,18.04 | 16.28,17.43 v16.04,17.68 | v17.14,22.77 17.14,23.46 17.12,23.48
  Bottom 0.508: U5.5 28.27,22.68 27.94,21.65 C1.1 27.93,20.01 27.93,19.47 27.7,19.23 24.96,19.23 24.59,19.6 v24.03,19.59 24.03,20.15 24.55,20.67 24.54,21.3 24.53,23.25 24.2,23.48 20.47,23.48 | U$6.VCC 14.45,20.08 | v16.04,17.68 16.1,17.74 16.1,19.86 15.88,20.08 14.45,20.08 | 20.47,23.48 19.05,23.48 17.12,23.48 14.82,23.47 14.44,23.17 14.43,20.1 14.45,20.08 | v21.42,30.04 20.47,29.11 20.47,23.48
5V  (via drill 0.33, 0.35)
  Top 0.152: U$1.24 18.47,14 18.73,13.73 18.95,13.54 19.39,13.97 19.59,13.97 22.33,11.23 22.65,11.18 22.92,11.45 U$1.14 | U$1.24 18.47,13.99 18.73,13.72 18.91,13.41 15.73,10.24 15.73,10.05 15.79,9.99 U$1.34 15.34,9.54 15.61,9.8 16.01,9.78 16.27,9.51 19.18,6.61 19.21,6.37 19.21,6.33 U$1.44 | v17.62,14.88 17.62,14.85 U$1.24 | R15.2 27.67,13.78 v26.89,14.55
  Top 0.508: LTC3200.1 28.94,20.19 C10.1 | C10.1 29.27,19.41 v30.23,19.39 | C10.1 28.8,19.92 v28.75,17.77
  Bottom 0.152: 27.47,11.77 27.91,12.13 | v26.89,14.55 v26.9,14.55 28.61,12.84
  Bottom 0.305: U5.3 33.05,23.17 33.2,23.57 32.92,24.08 32.91,24.08 32.76,24.36 32.6,24.63 32.33,24.74 32.13,24.84 U5.1
  Bottom 0.508: v30.23,19.39 30.22,20.61 31.14,21.14 31.09,21.1 31.49,21.33 31.57,21.85 31.59,22.02 31.77,22.45 U5.3 | v28.75,17.77 28.8,13.02 28.61,12.84 27.47,11.77 20.72,11.77 v17.62,14.88 | 27.91,12.13 27.91,9.92 27.68,9.69 27.68,9.07 28.12,8.64 28.74,8.64 29.47,8.66 J4.2
D5  (via drill 0.33)
  Top 0.152: U$1.31 15.38,12.14 v15.38,12.3 | v11.48,9.18 11.14,8.83 R10.2
  Top 0.305: R10.2 11.71,8.06 12.27,9.02 12.51,9.09 13.54,8.49 13.59,8.46 | 13.59,8.46 | 13.59,8.46 14.15,8.14 | 14.15,8.14 | 14.15,8.14 14.7,7.82 | 14.7,7.82 | 14.7,7.82 15.24,7.51 15.3,7.3 15.4,6.98 R9.1
  Bottom 0.152: v15.38,12.3 15.24,12.44 14.79,12.44 11.53,9.18 v11.48,9.18
D6  (via drill 0.33)
  Top 0.152: U$1.27 16.84,13.51 16.78,13.45 16.59,13.45 15.45,14.59 13.22,14.74 12.03,15.93 12.03,17.23 v11.34,17.92 | v10.6,26.41 12.33,27.34
  Top 0.305: R6.1 11.63,28.48 12.28,27.35 12.33,27.34 12.53,27.28 13.38,27.77 15.07,28.75 15.08,28.76 15.26,28.86 15.28,28.95 15.31,28.97 15.45,29.43 15.47,29.57 R8.2
  Bottom 0.152: v11.34,17.92 9.27,19.99 9.27,24.36 9.61,24.7 9.99,24.7 10.56,25.27 v10.6,26.41
D9  (via drill 0.33, 0.35)
  Top 0.152: v25.67,8.41 25.79,8.29 25.79,8.28 | v14.59,13.65 15.07,13.17 15.74,13.17 16.72,12.2 U$1.29
  Top 0.305: R5.2 23.83,6.67 23.98,7.23 25.79,8.28 26.86,8.91 27.48,8.69 R4.1
  Bottom 0.152: v25.67,8.41 25.58,8.23 25.1,7.96 24.6,7.98 24.3,8.28 24.11,8.28 23.97,8.41 23.4,8.41 18.16,13.65 v14.59,13.65
D10  (via drill 0.33, 0.35)
  Top 0.152: 24.84,28.34 24.95,28.28 | U$1.30 15.95,12.27 15.95,12.53 15.62,12.87 14.34,12.87 13.76,13.45 13.76,13.76 11.8,15.72 11.72,15.81 11.72,16.1 v11.35,16.47 | v17.56,28.21 17.56,28.2 17.81,27.94 20.4,27.94 20.41,27.95 20.91,27.94 25.43,27.94 25.45,27.97
  Top 0.305: R3.1 24.43,30.15 23.83,29.13 23.9,28.88 24.95,28.28 25.45,27.97 26.58,27.29 27.29,27.41 R7.2
  Bottom 0.152: v17.56,28.21 17.41,28.21 14.12,24.92 11.64,24.92 9.75,23.04 9.75,20.32 11.91,18.16 11.91,17.15 | 11.91,17.15 11.9,17.22 | v11.35,16.47 11.35,16.68 11.91,17.15
D11  (via drill 0.33)
  Top 0.152: U$1.12 23.66,10.58 24.13,10.12 26.18,10.12 26.83,10.43 26.85,10.42 26.86,10.43 27.94,10.13 28.38,10.57 29.2,10.57 v30.92,12.29 | v30.79,15.86 30.79,16.21 31.04,16.46
  Top 0.305: R13.2 32.21,16.28 31.22,16.28 31.04,16.46 31.04,17.32 31.04,19.87 31.31,20.22 R11.1
  Bottom 0.152: v30.92,12.29 30.92,15.74 v30.79,15.86
D12
  Top 0.152: U$1.26 17.13,13.92 R23.2
D13  (via drill 0.33)
  Top 0.152: v7.9,15.4 7.46,15.85 7.46,16.29 | v11.38,15.17 11.29,14.49 12.13,13.65 12.13,13.51 12.6,13.04 13,13.04 13.01,13.02 13.29,13.3 13.48,13.3 15.64,11.14 U$1.32
  Top 0.305: R1.1 7.03,16.29 7.46,16.29 8.05,16.29 8.23,16.47 8.23,17.73 8.23,18.37 8.23,19.57 8.24,19.95 7.81,20.26 R2.2
  Bottom 0.152: v11.38,15.17 11.06,15.4 v7.9,15.4
GND  (via drill 0.33, 0.35)
  Top 0.152: U$1.5 21.88,7.08 22.63,7.08 22.97,7.08 v23.73,7.84 | 13.04,9.99 C6.1 | R24.2 11.43,11.04 10.36,10.86 | 26.12,12.87 C7.1 26.35,13.76 v26.25,13.86 26.31,13.92 26.31,14.8 27.85,16.34 27.85,16.47 | 24.67,13.32 Y2.2 | LED3.C 11.28,13.96 9.86,13.96 | v26.46,6.37 26.14,6.86 25.71,7.03 Q2.2 | 18.39,32.65 U$9.GND | 18.39,32.65 U$9.CSB 18.39,31.03 C17.2 | U$9.CSB(PIN5) 19.89,35.19 19.36,35.72 17.42,35.72 17.29,35.58 17.29,33.54 17.29,32.79 17.44,32.64 18.38,32.64 18.39,32.65 | U$1.35 15.67,9.11 15.32,8.76 15.05,8.89 14.64,9.31 14.18,8.84 13.7,8.84 12.28,10.26 11.33,10.26 | 10.81,19.07 10.64,18.9 | U2.9 19.38,16.28 19.03,15.94 19.03,15.45 19.37,15.11 19.86,15.11 20.2,15.45 20.2,15.54 | 20.2,15.54 20.2,16.48 20.18,16.49 U2.11 | U2.20 20.25,19.73 20.25,20.12 20.45,20.31 20.72,20.31 20.91,20.12 20.91,19.4 U2.18 22.36,19.18 v22.54,18.99 23.36,18.18 23.36,17.56 23.37,17.53 23.37,17.23 23.13,17 23.04,16.91 22.95,16.82 22.95,16.7 22.95,16.24 22.23,15.51 22.13,15.43 21.86,15.43 C12.2 20.34,15.39 20.2,15.54 | C13.2 10.23,18.93 9.84,18.53 | J1.SHELL J1.SHELL1 J1.SHELL2 J1.SHELL3 | 21.04,4.03 21.04,3.47 21.05,3.46 21.05,3.15 21.36,3.15 21.51,3 22.18,3 22.35,3.17 v22.94,3.17 | U$1.15 22.93,12.17 23.36,12.18 24.05,12.87 Y2.2 | Y2.2 v24.11,12.86 | U$1.23 18.2,14.98 18.2,15.12 16.86,16.45 v16.09,16.45 | LTC3200.2 30.18,21.67 29.63,21.67 29.02,21.32 C10.2
  Top 0.2: v14.76,3.03 14.73,3.68 15.02,4.2 15.64,5.3 16.34,6 | 16.34,6 18.15,6 U$1.43 | U$1.35 15.6,9.12 15.3,8.82 15.39,8.52 16.11,6.17 16.34,6 | U$1.15 | C4.1 v31.01,23.09 | C6.1 12.96,10.26 11.33,10.26 10.27,10.26 9.84,10.69 9.84,11.55
  Top 0.508: Q1.2 27.5,29.95 R7.1 J3.1 | Q4.2 11.43,6.2 R10.1 9.12,7.63 9.12,11.48 9.19,11.55 9.84,11.55 | Q2.2 25.75,5.42 R5.1 24.83,4.2 v24.21,3.59 24.21,1.8 J1.SHELL3 | Q6.2 33.9,17.05 R13.1 | Q5.2 5.43,19 R2.1 5.64,20.54 5.64,20.94 5.88,21.18 7.16,21.18 8.42,21.18 9.85,21.15 | v14.76,3.03 15.54,2.63 15.77,2.4 J1.SHELL | J4.6 32.13,14.38 | 10.64,18.9 9.84,18.53 | 26.02,22.65 26.12,21.43 | 16.16,26.72 16.15,30.41 16.05,30.61 15.37,31.77 R8.1 13.62,31.53 13.28,31.1 Q3.2 | C17.2 17.18,30.18 16.81,29.64 16.81,26.72 | 26.11,22.84 23.57,22.84 22.34,21.61 22.34,21.49 21.99,21.14 21.99,19.54 v22.54,18.99
  Top 1.016: C10.2 26.12,21.43
  Top 1.27: 30.22,14.36 32.13,14.38 33.93,14.39 34.36,14.83 R13.1 | J3.1 31.49,28.58 30.99,28.29 30.97,28.2 27.58,25.72
  Top 2: 26.09,25.72 27.58,25.72 | 10.36,10.86 9.84,11.55 9.86,13.96 9.84,18.53 9.85,21.15 9.85,22.3 v9.84,24.13 14.66,26.71 14.67,26.72 16.16,26.72 16.81,26.72 20.91,26.72 24.74,26.71 25.74,25.72 26.09,25.72 | 26.09,25.72 26.12,21.43 26.13,18.04 26.29,17.87 27.85,16.47 30.22,14.36
  Bottom 0.152: 22.73,6.74 C5.2 22.95,7.06 v23.73,7.84 23.73,6.44 24.61,5.56 25.66,5.56 v26.46,6.37 | U$6.GND 11.32,25.6 v9.84,24.13 | C14.2 19.46,18.06 19.46,18.61 19.6,18.74 20.64,18.74 22.29,18.74 v22.54,18.99 | C3.2 13.75,4.04 v14.76,3.03 | v24.11,12.86 24.67,13.42 25.81,13.42 v26.25,13.86
  Bottom 0.2: v22.94,3.17 22.94,2.15 22.52,1.68 19.43,1.66 | 19.43,1.66 15.92,1.66 14.73,2.54 14.73,3.13 v14.76,3.03 | D1.C 19.39,1.7 19.43,1.66 | R19.2 20.87,8.07 21.84,8.07 21.99,7.93 21.99,7.17 21.98,7.16 21.98,6.68 21.87,6.6 IC2.2 | U5.2 v31.01,23.09
  Bottom 0.203: C5.2 21.98,6.68
  Bottom 0.508: 32.12,14.9 J4.6 | LED2.C 9.21,29.71 v8.35,29.71 | v24.21,3.59 23.37,3.59 v22.94,3.17
  other vias: 35.08,13.31 6.55,12.07 5.08,11.94 5.73,13.21 6.4,22.5 7.81,22.53 4.75,22.4 15.8,33.63 23.69,33.43
  pour Top: 7.03,34.03 11.88,36.58 27.33,36.78 31.67,34.13 39.62,20.73 40.18,15.1 32.28,2 27.38,-0.22 12.22,-0.72 7.44,1.79 -0.76,15.04 -0.76,20.63
  pour Bottom: -1.28,16.11 -1.02,20.81 6.68,34.88 11.58,37.08 27.36,37.08 32.27,34.67 40.16,20.87 40.53,15.48 32.57,2.07 27.68,-0.52 11.99,-0.87 7.24,1.78
MISO  (via drill 0.33)
  Top 0.152: v28.43,9.38 28.14,9.39 27.92,9.42 26.86,9.72 26.35,9.48 26.14,9.48 24.21,9.48 U$1.11
  Bottom 0.152: v28.43,9.38 29.77,9.43 31.4,7.8 31.4,7.66 J4.1
MOSI
  Top 0.152: J4.4 29.24,9.14 29.16,9.12 28.9,8.75 27.93,8.76 27.7,9.11 26.87,9.36 26.45,9.14 25.93,9.14 24.58,9.14 24.26,9.16 23.93,8.88 23.6,8.89 23.32,9.14 U$1.10
N$1
  Top 0.508: Q5.1 5.53,17.07 R1.2
N$2  (via drill 0.35)
  Top 0.152: v19.65,28.98 22.86,28.98 v23.31,28.53 | v28.03,24.18 28.03,23.61 27.79,23.47 27.74,23.29 28.28,22.37 | 28.28,22.37 | 28.28,22.37 28.44,22.09 28.58,22.04 28.95,21.91 29.04,21.89 29.98,22.41
  Top 0.508: S2.3 33.37,21.55 C4.2 LTC3200.3 31.07,22.33 29.98,22.41 LTC3200.5
  Bottom 0.152: R20.2 6.66,26.55 6.66,27.6 6.99,27.93 7.44,28.71 7.63,28.76 8.6,28.19 9.17,28.19 10.01,27.71 | 10.01,27.71 | 10.01,27.71 10.44,27.46 10.62,27.51 10.8,27.82 10.87,27.94 11.51,27.94 11.53,27.92 14.12,27.92 14.14,27.94 16.48,27.94 17.32,28.78 19.45,28.78 v19.65,28.98 | v23.31,28.53 24.42,28.53 25.17,27.78 27.62,27.78 27.75,27.65 27.75,27.05 R16.2 28.03,25.84 v28.03,24.18
N$3  (via drill 0.33)
  Top 0.2: v2.2,16.68 U$7.P$4
  Top 0.508: Q5.3 4.3,17.03 2.94,16.83 2.79,16.68 | 2.79,16.68 | 2.79,16.68 | 2.79,16.68 2.53,16.68 1.93,16.68 U$7.P$4
  Bottom 0.2: v2.2,16.68 PAD20.1
N$4
  Top 0.508: Q6.1 33.94,19.01 R11.2
N$5
  Bottom 0.508: LED1.A R16.1
N$7  (via drill 0.33)
  Top 0.2: v36.98,19.67 U$8.P$4
  Top 0.508: Q6.3 34.99,19.03 36.11,19.39 36.38,19.66 | 36.38,19.66 | 36.38,19.66 | 36.38,19.66 36.66,19.66 36.91,19.66 36.95,19.66 v36.98,19.67
  Bottom 0.2: PAD24.1 v36.98,19.67
N$8
  Top 0.508: Q1.1 25.75,30.84 25.77,30.86 R3.2
N$9  (via drill 0.33)  (1 unrouted)
  Top 0.2: U$3.P$4 v26.93,33.87
  Top 0.508: Q1.3 26.51,31.23 26.3,31.67 26.75,33.26 26.7,33.46 26.83,33.69 v26.94,33.87
  Bottom 0.2: v26.93,33.87 PAD12.1
N$10
  Bottom 0.508: R20.1 8.45,27.09 LED2.A
N$11
  Top 0.508: Q2.1 27.55,6.38 R4.2
N$12  (via drill 0.33)
  Top 0.2: v29.6,3.88 U$2.P$4
  Top 0.508: Q2.3 27.79,4.8 28.51,4.35 28.79,4.51 29.04,4.45 29.3,4.38 | U$2.P$4 29.76,3.58 29.43,4.15 29.3,4.38 | 29.3,4.38
  Bottom 0.2: v29.6,3.88 PAD10.1
N$13
  Top 0.152: 19.12,4.84 J1.2
  Top 0.2: 19.12,4.84 19.26,4.99 21.38,4.99 | 21.38,4.99 | 21.38,4.99 21.81,4.99 R12.1
N$14
  Top 0.508: R6.2 11.5,30.17 Q3.1
N$15  (via drill 0.33)
  Top 0.2: v9.6,32.49 U$4.P$4
  Top 0.406: Q3.3 11.24,30.85 10.09,32 9.93,32.04 | 9.93,32.04 | 9.93,32.04 9.78,32.31 v9.6,32.49
  Top 0.508: 9.5,32.59 v9.6,32.49
  Bottom 0.2: PAD14.1 v9.6,32.49
N$16
  Top 0.152: 23.13,4.32 23.13,3.79 23.51,3.4 23.51,2.93 23.18,2.59 20.27,2.59 19.77,3.09 J1.3
  Top 0.2: 23.13,4.32 23.13,5.36 R14.1
N$17
  Top 0.508: Q4.1 13.42,5.45 13.37,4.86 R9.2
N$18  (via drill 0.33)
  Top 0.2: v12.21,2.36 U$5.P$4
  Top 0.508: Q4.3 12.6,4.24 12.39,3.26 12.5,2.88 12.36,2.64 12.21,2.38 v12.21,2.36
  Bottom 0.2: v12.21,2.36 PAD16.1
N$22
  Top 0.152: U$1.17 22.44,13.05 23.18,13.79 23.27,13.91 23.3,13.79 23.19,13.96 Y2.1
N$23
  Top 0.2: LTC3200.6 28.76,23.37 28.54,23.76 28.59,23.96 29.26,24.35 29.42,24.44 30.02,24.79 C9.1
N$24  (via drill 0.35)
  Top 0.152: U2.10 19.78,15.86 v19.62,15.69
  Bottom 0.152: v19.62,15.69 20.12,16.2 C14.1
N$25
  Top 0.2: LTC3200.4 30.9,24.3 C9.2
N$26
  Bottom 0.152: D4.C 15.2,3.67 R17.1
N$27
  Bottom 0.152: R17.2 16.98,4.23 17.36,4.61 18.49,4.61 18.59,4.72
  Bottom 0.2: 19.95,5.01 19.86,5.09 18.83,5.09 18.59,4.86 18.59,4.72 | 19.95,5.01 20.1,4.86 20.1,4.73 R18.2 | 19.95,5.01 20.29,5.35 20.29,6.98 20.44,7.12 20.72,7.12 IC2.1
N$28
  Bottom 0.2: R18.1 20.14,2.98 20.14,3.07 19.39,3.82 D1.A
N$29
  Top 0.152: U$1.16 22.53,12.49 22.98,12.56 24.37,13.95 24.56,13.95 25.19,13.32 25.19,13.31 25.51,12.99 25.51,12.84 24.96,12.29 Y2.3
N$30
  Top 0.152: R23.1 15.14,15.9 LED3.A
N$32
  Bottom 0.2: IC2.5 18.54,8.67 R19.1
N$33
  Top 0.152: U$1.33 15.3,10.78 14.07,12.01 13.72,12.37 R24.1
N$34  (via drill 0.33)
  Top 0.152: U$1.42 18.1,6.66 17.84,6.39 17.52,6.42 17.27,6.67 v16.71,6.67 | v13.94,9.42 13.94,10.92 C6.2
  Bottom 0.152: v16.71,6.67 16.69,6.67 v13.94,9.42
N$36  (via drill 0.33)
  Top 0.152: C7.2 26.8,11.48 v25.83,11 | v24.84,8.55 24.64,8.56 24.61,8.56 24.27,8.57 23.78,8.56 23.64,8.57 22.53,7.46 22.2,7.45 U$1.6
  Bottom 0.152: v25.83,11 24.84,10.09 24.84,8.56 v24.84,8.55
RESET  (via drill 0.33)
  Top 0.152: U$1.13 23.3,11.1 23.73,11.53 23.94,11.42 24.28,11.06 24.28,10.59 24.44,10.43 26.12,10.43 26.33,10.53 26.69,10.7 26.79,10.75 26.81,10.75 26.82,10.76 | 26.82,10.76 | 26.82,10.76 26.83,10.75 26.84,10.76 27.85,10.48 28.26,10.88 28.46,10.88 v28.97,11.15 28.87,11.25 R15.1
  Bottom 0.152: v28.97,11.15 29.5,11.68 J4.5
RX  (via drill 0.33, 0.35)
  Top 0.152: v12.81,19.89 18.28,24.92 v23.39,24.91 | U$1.20 20.87,13.61 v22.09,14.83
  Bottom 0.152: U$6.UART_TX 24.77,30.1 23.89,30.1 23.75,29.97 23.75,29.7 23.42,29.36 23.1,29.36 23.09,29.36 23.03,29.36 22.79,29.12 22.7,29.04 22.7,29.03 22.32,29.03 22.21,28.92 21.56,28.27 21.56,26.25 21.89,25.91 23.06,25.91 23.39,25.58 v23.39,24.91 | v22.09,14.83 18.52,14.83 18.09,15.28 16.26,17.1 15.8,17.1 13.02,19.89 v12.81,19.89
SCK  (via drill 0.33)
  Top 0.152: v29.3,10 | U$1.9 22.93,8.81 22.58,9.16 22.69,9.43 23.39,10.13 23.64,10.14 23.93,9.85 24.01,9.82 26.27,9.81 26.87,10.1 28.02,9.78 28.24,10 v29.3,10
  Bottom 0.152: v29.3,10 31.48,10 32.36,9.12 32.69,9.12 J4.3
SCL  (via drill 0.33)
  Top 0.152: U$1.18 22.08,13.44 22.13,13.49 22.14,13.5 23.47,14.83 23.87,14.83 24.8,15.76 24.7,15.98 24.56,16.12 R22.1 24.56,17.39 24.53,17.42 24.53,17.44 24.07,17.9 24.07,18.81 24.6,19.35 24.6,20.98 v23.69,21.89 | v23.18,29.94 21.99,30.27 21.99,30.28 21.39,30.88 U$9.SCLK | v20.03,22.59 20.04,22.82 20.34,23.24 22.24,23.23 22.61,23.69 v22.62,24.29 | v17.28,21.52 17.28,20.75 18.53,20.75 18.97,20.31 U2.23
  Bottom 0.152: v20.03,22.59 18.9,22.61 18.43,22.17 18.41,22.17 18.15,21.9 17.76,21.89 17.66,21.89 v17.28,21.52 17.65,21.89 v23.69,21.89 | v22.62,24.29 22.44,24.29 21.83,24.9 21.44,24.9 21.26,25.08 21.26,28.4 22.2,29.34 22.58,29.34 v23.18,29.94
SDA  (via drill 0.33)
  Top 0.152: 23.69,17.76 23.69,17.65 23.71,17.58 23.69,17.53 23.69,17.12 23.26,16.7 23.26,16.37 R21.1 24.12,15.53 24.12,15.52 23.75,15.14 23.35,15.14 23.17,14.96 | 23.69,17.76 | 23.69,17.76 23.68,17.87 23.68,18.01 23.68,18.36 23.7,18.45 23.68,18.49 23.68,18.52 23.09,19.44 v23.09,21.3 | v22.78,30.87 22.78,32.23 22.3,32.71 21.41,32.71 U$9.SDI/SDA | v21.59,24.33 20.87,23.61 19.29,23.61 18.32,22.64 v18.07,22.64 | v16,20.84 15.93,20.77 15.93,20.03 16.17,19.8 18.52,19.8 U2.24 | U$1.19 21.27,13.34 21.59,13.66 21.78,13.58 21.87,13.66 21.92,13.72 21.99,13.79 22,13.79 23.17,14.96 | 23.17,14.96
  Bottom 0.152: 22.98,21.41 v23.09,21.3 22.38,21.3 22.31,21.37 19.19,21.37 18.74,20.92 17.53,20.92 17.51,20.94 16.1,20.94 v16,20.84 16.85,22.18 17.64,22.2 v18.07,22.64 | v22.78,30.87 22.8,30.48 22.51,30.09 20.95,28.53 20.95,24.95 21.58,24.33 v21.59,24.33
TX  (via drill 0.33, 0.35)
  Top 0.152: v24.45,24.89 24.22,24.89 23.63,25.48 23.16,25.48 22.9,25.22 18.16,25.23 18.16,25.22 18.15,25.22 17.79,24.89 12.97,20.46 12.02,20.46 11.78,20.27 v11.78,19.86 | U$1.21 20.57,14.06 20.83,14.32 20.75,14.59 20.4,14.94 20.11,14.94 19.98,14.81 19.25,14.81 17.15,16.91 17.15,16.98 17.1,17.04 13.78,17.04 v12.49,18.33
  Bottom 0.152: v11.78,19.86 11.78,19.43 12.49,18.72 v12.49,18.33 | v24.45,24.89 24.45,26.55 24.99,27.1 U$6.UART_RX
USBD+
  Top 0.2: U$1.4 21.55,6.69 22.83,6.69 R14.2
USBD-
  Top 0.2: R12.2 21.51,6.01 U$1.3
VDD  (via drill 0.33)  (2 unrouted)
  Top 0.2: v12.23,34 U$4.P$3 | 9.38,3.48 U$5.P$3 | 9.38,3.48 9.13,3.04 | v9.58,3.86 9.38,3.48 | v29.55,32.38 U$3.P$3 | v26.99,2.36 U$2.P$3 | v36.98,16.66 U$8.P$3 | v2.19,19.68 U$7.P$3
  Top 1.016: v34.97,24.94 33.51,24.07 S2.2
  Bottom 0.152: v9.58,3.86 9.32,3.88 | v29.55,32.38 29.75,32.22 | v2.19,19.68 2.13,19.93 | v12.23,34 12.06,34.17 | v26.99,2.36 26.81,2.19
  Bottom 0.2: PAD13.1 v12.23,34 | PAD15.1 v9.58,3.86 | PAD11.1 v29.55,32.38 | PAD9.1 v26.99,2.36 | v36.98,16.66 PAD23.1 | PAD19.1 v2.19,19.68
  Bottom 0.406: 7.38,31.59 9.16,31.51 9.17,31.51 9.22,31.51 9.28,31.49 9.31,31.51 9.4,31.51 9.89,31.79 10.2,31.97 10.4,31.92 | 10.4,31.92 | 10.4,31.92 | 10.4,31.92 10.63,32.05 11.9,32.78 | 11.9,32.78 | 11.9,32.78 12.12,32.91 12.32,33.02 | 12.32,33.02 | 12.32,33.02 | 12.32,33.02 12.38,33.27 12.44,33.49 | 12.44,33.49 | 12.44,33.49 | 12.44,33.49 12.31,33.71 12.2,33.91 12.05,34.16 12.06,34.17 12.4,34.17 | 25.56,33.42 26.45,32.53 27.68,32.53 28.47,32.07 28.6,31.99 28.8,31.88 | 28.8,31.88 | 28.8,31.88 | 28.8,31.88 | 28.8,31.88 | 28.8,31.88 28.81,31.88 29.66,32.07
  Bottom 0.508: IC2.3 22.48,5.65 C5.1 25.29,5.01 26.62,3.56
  Bottom 1.016: 29.66,32.07 29.75,32.22 J3.2 31.34,31.37 31.1,30.35 30.76,29.07 31.42,27.92 31.94,27.53 32.57,26.42 32.93,25.76 33.47,24.76 | 25.23,35.47 25.56,33.42 | 25.23,35.47 | 25.23,35.47 13.97,35.48 12.4,34.17 | 7.38,31.59 | 7.38,31.59 4.91,27.33 1.77,21.88 2.15,19.93 | 2.9,19.93 | 2.9,19.93 | 2.9,19.93 3.19,19.64 3.42,19.41 | 3.42,19.41 | 3.42,19.41 | 3.42,19.41 3.42,18.99 3.42,17.32 3.42,16.95 | 3.42,16.95 | 2.06,20.41 2.13,19.93 2.9,19.93 | 3.42,16.95 3.42,15.97 3.21,15.76 2.82,15.38 2.78,15.38 2.78,15.36 1.81,14.38 7.73,4.17 9.32,3.88 9.37,3.96 9.36,3.96 9.55,4.27 9.73,4.6 10.09,4.69 10.44,4.79 10.45,4.79 10.76,4.6 11.08,4.42 12.26,3.73 12.52,3.58 12.54,3.58 13.77,2.81 14.38,0.89 | 14.38,0.89 | 14.38,0.89 25.45,0.89 26.81,2.19 | 26.4,1.79 26.76,2.27 26.43,2.84 26.43,2.85 26.52,3.2 26.62,3.56 26.94,3.74 27.26,3.92 28.43,4.6 28.56,4.67 29.73,5.39 31.8,4.71 37.64,14.89 37.07,16.41 | 37.07,16.41 v36.98,16.66 | 33.47,24.76 34.25,23.36 34.2,23.44 34.32,23.27 35.69,20.77 35.76,20.57 35.76,19.39 35.76,19.02 35.76,18.66 | 35.76,18.66 | 35.76,18.66 35.76,17.66 | 35.76,17.66 | 35.76,17.66 35.76,17.28 35.76,16.93 | 35.76,16.93 | 35.76,16.93 36.01,16.68 36.28,16.41 | 36.28,16.41 | 36.28,16.41 36.59,16.41 37.01,16.41 | 37.01,16.41 | 37.01,16.41 37.07,16.41 | v34.97,24.94 33.78,24.25 33.47,24.76
VUSB  (via drill 0.33)
  Top 0.152: 18.49,4.15 18.49,4.83 19.51,5.85 19.51,6.25 19.86,6.59 20.18,6.63 20.44,6.37 U$1.2 20.48,6.35 20.13,6.7 20.22,6.95 21.62,8.36 21.81,8.36 21.99,8.37 U$1.7 | 18.49,4.15 18.5,4.14 18.5,4.03 J1.1 | 18.49,4.15 18.03,4.61 17.89,4.61 v17.1,5.41
  Bottom 0.152: 16.59,5.41 16.59,5.98 15.58,7 14.06,7 C3.1 | C3.1 14.61,6.69 D4.A | C3.1 15.89,6.69 16.48,6.1 17.34,6.1 17.5,5.94
  Bottom 0.2: v17.1,5.41 16.59,5.41 | 17.5,5.94 17.81,5.63 18.53,5.63 IC2.4
(copper drawn outside any net)
  shapes: Top area x2

### Text on the board
tPlace: Designed By Anshul